# Altium project JLINK-ADPT.PrjPcb
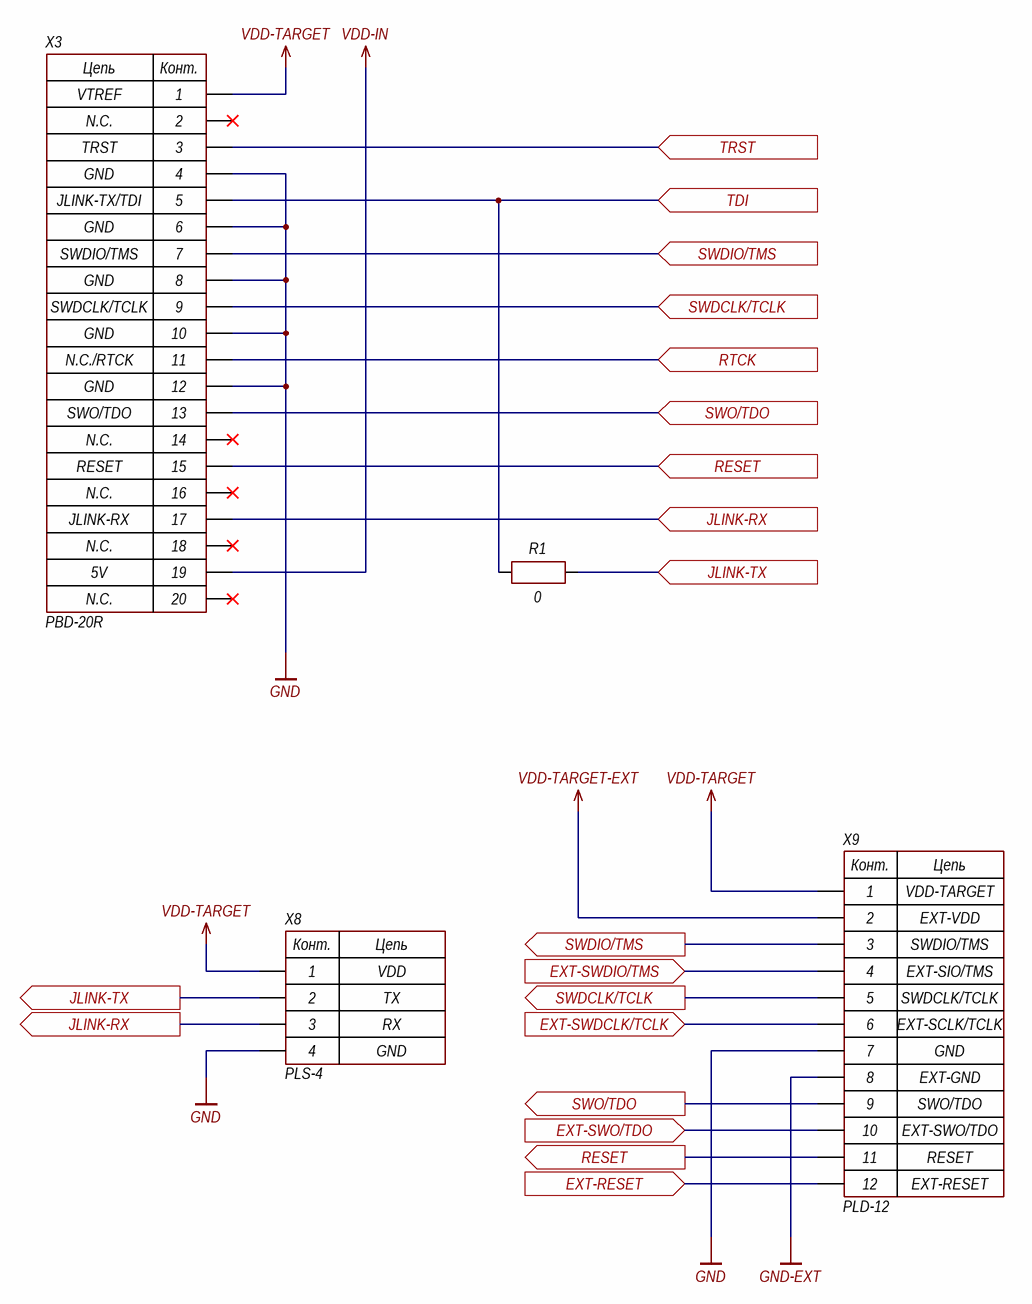
[diagram p0: Connecors-Input.SchDoc]
ProjectVersion: 1.1; ProjectNumberAssembly: JLINK-ADPT-MAINB-1.0 СБ; ProjectNumber: JLINK-ADPT; ProjectDescription: J-link adapter board with different connectors; ProjectDateShort: 2021.10; ProjectDate: 31.10.2021; ProjectCompanyName: Azek Clark © 2021; ProjectBoardType: MAINB; ProjectAuthor: Clark A.
4 sheets, 55 parts. Net scope: flat (ports and power ports of the same name join across sheets).
Board file: PCB.PcbDoc
Sheets:
  Connecors-Input.SchDoc
  Connecors-Output.SchDoc
  PowerSupply.SchDoc
  J-Flash.SchDoc

## Sheet Connecors-Input.SchDoc: =ProjectDescription
size 420 x 297 mm; Author: Clark A.; CompanyName: Azek Clark © 2021; Address1: Address1; Address2: Address2; Address3: Address3; Address4: Address4; DocumentNumber: JLINK-ADPT-1.1-MAINB Э3; SheetNumber: 1; SheetTotal: 3; Scale: 1:1; DocumentType: Схема электрическая принципиальная; FirstReferrence: JLINK-ADPT

### Parts
R1  0  [CH0402R]
X3  PBD-20R  [CON: PBD-20R]
X8  PLS-4  [CON: PLS-4]
X9  PLD-12  [CON: PLD-12]

### Ports
EXT-RESET (in), EXT-SWDCLK/TCLK (in), EXT-SWDIO/TMS (in), EXT-SWO/TDO (in), JLINK-RX (in), JLINK-RX (out), JLINK-TX (in), JLINK-TX (out), RESET (in), RESET (out), RTCK (in), SWDCLK/TCLK (in), SWDCLK/TCLK (out), SWDIO/TMS (in), SWDIO/TMS (out), SWO/TDO (in), SWO/TDO (out), TDI (in), TRST (in)

### Nets
GND: X3.4 X3.6 X3.8 X3.10 X3.12 X8.4 X9.7
GND-EXT: X9.8
VDD-IN: X3.19
VDD-TARGET: X3.1 X8.1 X9.1
VDD-TARGET-EXT: X9.2
EXT-RESET: X9.12 ; port EXT-RESET
EXT-SWDCLK/TCLK: X9.6 ; port EXT-SWDCLK/TCLK
EXT-SWDIO/TMS: X9.4 ; port EXT-SWDIO/TMS
EXT-SWO/TDO: X9.10 ; port EXT-SWO/TDO
JLINK-RX: X3.17 X8.3 ; port JLINK-RX
JLINK-TX: R1.2 X8.2 ; port JLINK-TX
RESET: X3.15 X9.11 ; port RESET
RTCK: X3.11 ; port RTCK
SWDCLK/TCLK: X3.9 X9.5 ; port SWDCLK/TCLK
SWDIO/TMS: X3.7 X9.3 ; port SWDIO/TMS
SWO/TDO: X3.13 X9.9 ; port SWO/TDO
TDI: R1.1 X3.5 ; port TDI
TRST: X3.3 ; port TRST

Not connected (* = marked no-connect by the designer): X3 2* 14* 16* 18* 20*

### Notes on the sheet
- VTREF
- N.C.
- TRST
- GND
- JLINK-TX/TDI
- SWDIO/TMS
- SWDCLK/TCLK
- N.C./RTCK
- SWO/TDO
- JLINK-RX
- RESET
- 5V
- EXT-VDD
- VDD-TARGET
- VDD
- EXT-SIO/TMS
- TX
- RX
- (near X9) EXT-SCLK/TCLK
- EXT-SWO/TDO
- EXT-GND
- EXT-RESET
- Разраб.
- Изм.
- Лист
- № докум.
- Подп.
- Дата
- Лит.
- Масса
- Масштаб
- Пров.
- Т.контр.
- Листов
- Утв.
- Н.контр.
- 2.106-A3
- Копировал
- Формат А3
- (in symbol 4-Connector) Конт.; Цепь
- (in symbol 12-Connector) Конт.; Цепь
- (in symbol 20-Connector) Цепь; Конт.

### Library data of the parts
R1 = Resistor: Manufacturer: *; Model: *; HelpURL: *; ComponentKind: *; Value: 0; ClassName: JLINK-CONNECTOR
X3 = 20-Connector: Model: PBD-20R; Manufacturer: *; HelpURL: *; ComponentKind: *; ClassName: JLINK-CONNECTOR
X8 = 4-Connector: Model: PLS-4; Manufacturer: *; HelpURL: *; ComponentKind: *; ClassName: *
X9 = 12-Connector: Model: PLD-12; Manufacturer: *; HelpURL: *; ComponentKind: *

## Sheet Connecors-Output.SchDoc: =ProjectDescription
size 420 x 297 mm; Author: Clark A.; CompanyName: Azek Clark © 2021; Address1: Address1; Address2: Address2; Address3: Address3; Address4: Address4; DocumentNumber: JLINK-ADPT-1.1-MAINB Э3; SheetNumber: 2; SheetTotal: 4; Scale: 1:1; DocumentType: Схема электрическая принципиальная; FirstReferrence: JLINK-ADPT
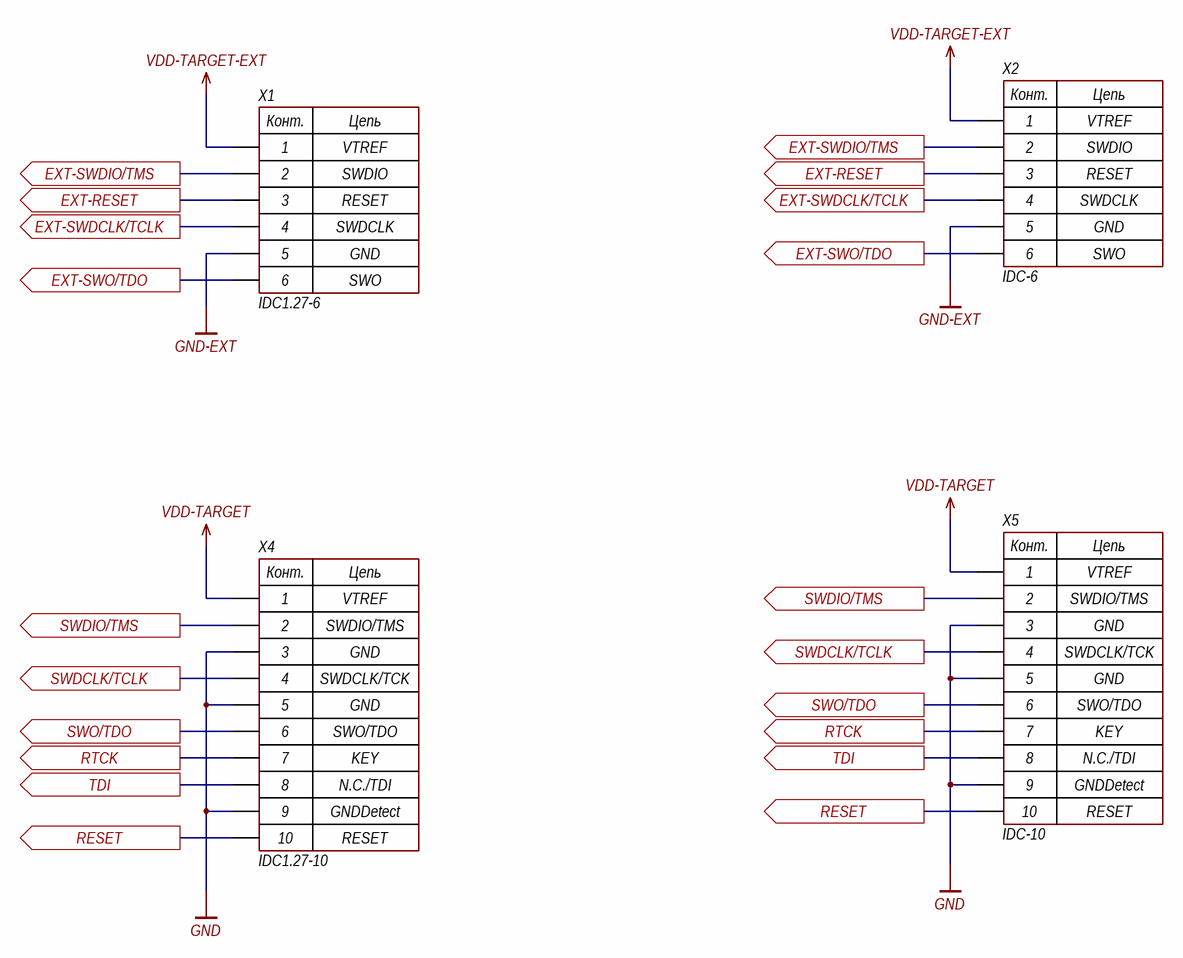
[diagram p1: Connecors-Output.SchDoc]

### Parts
X1  IDC1.27-6  [CON: IDC1.27-6]
X2  IDC-6  [CON: IDC-6MS]
X4  IDC1.27-10  [CON: IDC1.27-10]
X5  IDC-10  [CON: IDC-10MS]

### Ports
EXT-RESET (out), EXT-SWDCLK/TCLK (out), EXT-SWDIO/TMS (out), EXT-SWO/TDO (out), RESET (out), RTCK (out), SWDCLK/TCLK (out), SWDIO/TMS (out), SWO/TDO (out), TDI (out)

### Nets
GND: X4.3 X4.5 X4.9 X5.3 X5.5 X5.9
GND-EXT: X1.5 X2.5
VDD-TARGET: X4.1 X5.1
VDD-TARGET-EXT: X1.1 X2.1
EXT-RESET: X1.3 X2.3 ; port EXT-RESET
EXT-SWDCLK/TCLK: X1.4 X2.4 ; port EXT-SWDCLK/TCLK
EXT-SWDIO/TMS: X1.2 X2.2 ; port EXT-SWDIO/TMS
EXT-SWO/TDO: X1.6 X2.6 ; port EXT-SWO/TDO
RESET: X4.10 X5.10 ; port RESET
RTCK: X4.7 X5.7 ; port RTCK
SWDCLK/TCLK: X4.4 X5.4 ; port SWDCLK/TCLK
SWDIO/TMS: X4.2 X5.2 ; port SWDIO/TMS
SWO/TDO: X4.6 X5.6 ; port SWO/TDO
TDI: X4.8 X5.8 ; port TDI

### Notes on the sheet
- VTREF
- SWDIO
- SWDCLK
- RESET
- GND
- SWO
- SWDIO/TMS
- SWDCLK/TCK
- KEY
- SWO/TDO
- N.C./TDI
- GNDDetect
- Изм.
- Лист
- № докум.
- Подп.
- Дата
- 2.106-A3
- Копировал
- Формат А3
- (in symbol 6-Connector) Конт.; Цепь
- (in symbol 10-Connector) Конт.; Цепь

### Library data of the parts
X1 X2 = 6-Connector: Manufacturer: *; HelpURL: *; ComponentKind: *; ClassName: *
  X1: Model: IDC1.27-6
  X2: Model: IDC-6
X4 X5 = 10-Connector: Manufacturer: *; HelpURL: *; ComponentKind: *; ClassName: *
  X4: Model: IDC1.27-10
  X5: Model: IDC-10

## Sheet PowerSupply.SchDoc: =ProjectDescription
size 420 x 297 mm; Author: Clark A.; CompanyName: Azek Clark © 2021; Address1: Address1; Address2: Address2; Address3: Address3; Address4: Address4; DocumentNumber: JLINK-ADPT-1.1-MAINB Э3; SheetNumber: 2; SheetTotal: 2; Scale: 1:1; DocumentType: Схема электрическая принципиальная; FirstReferrence: JLINK-ADPT
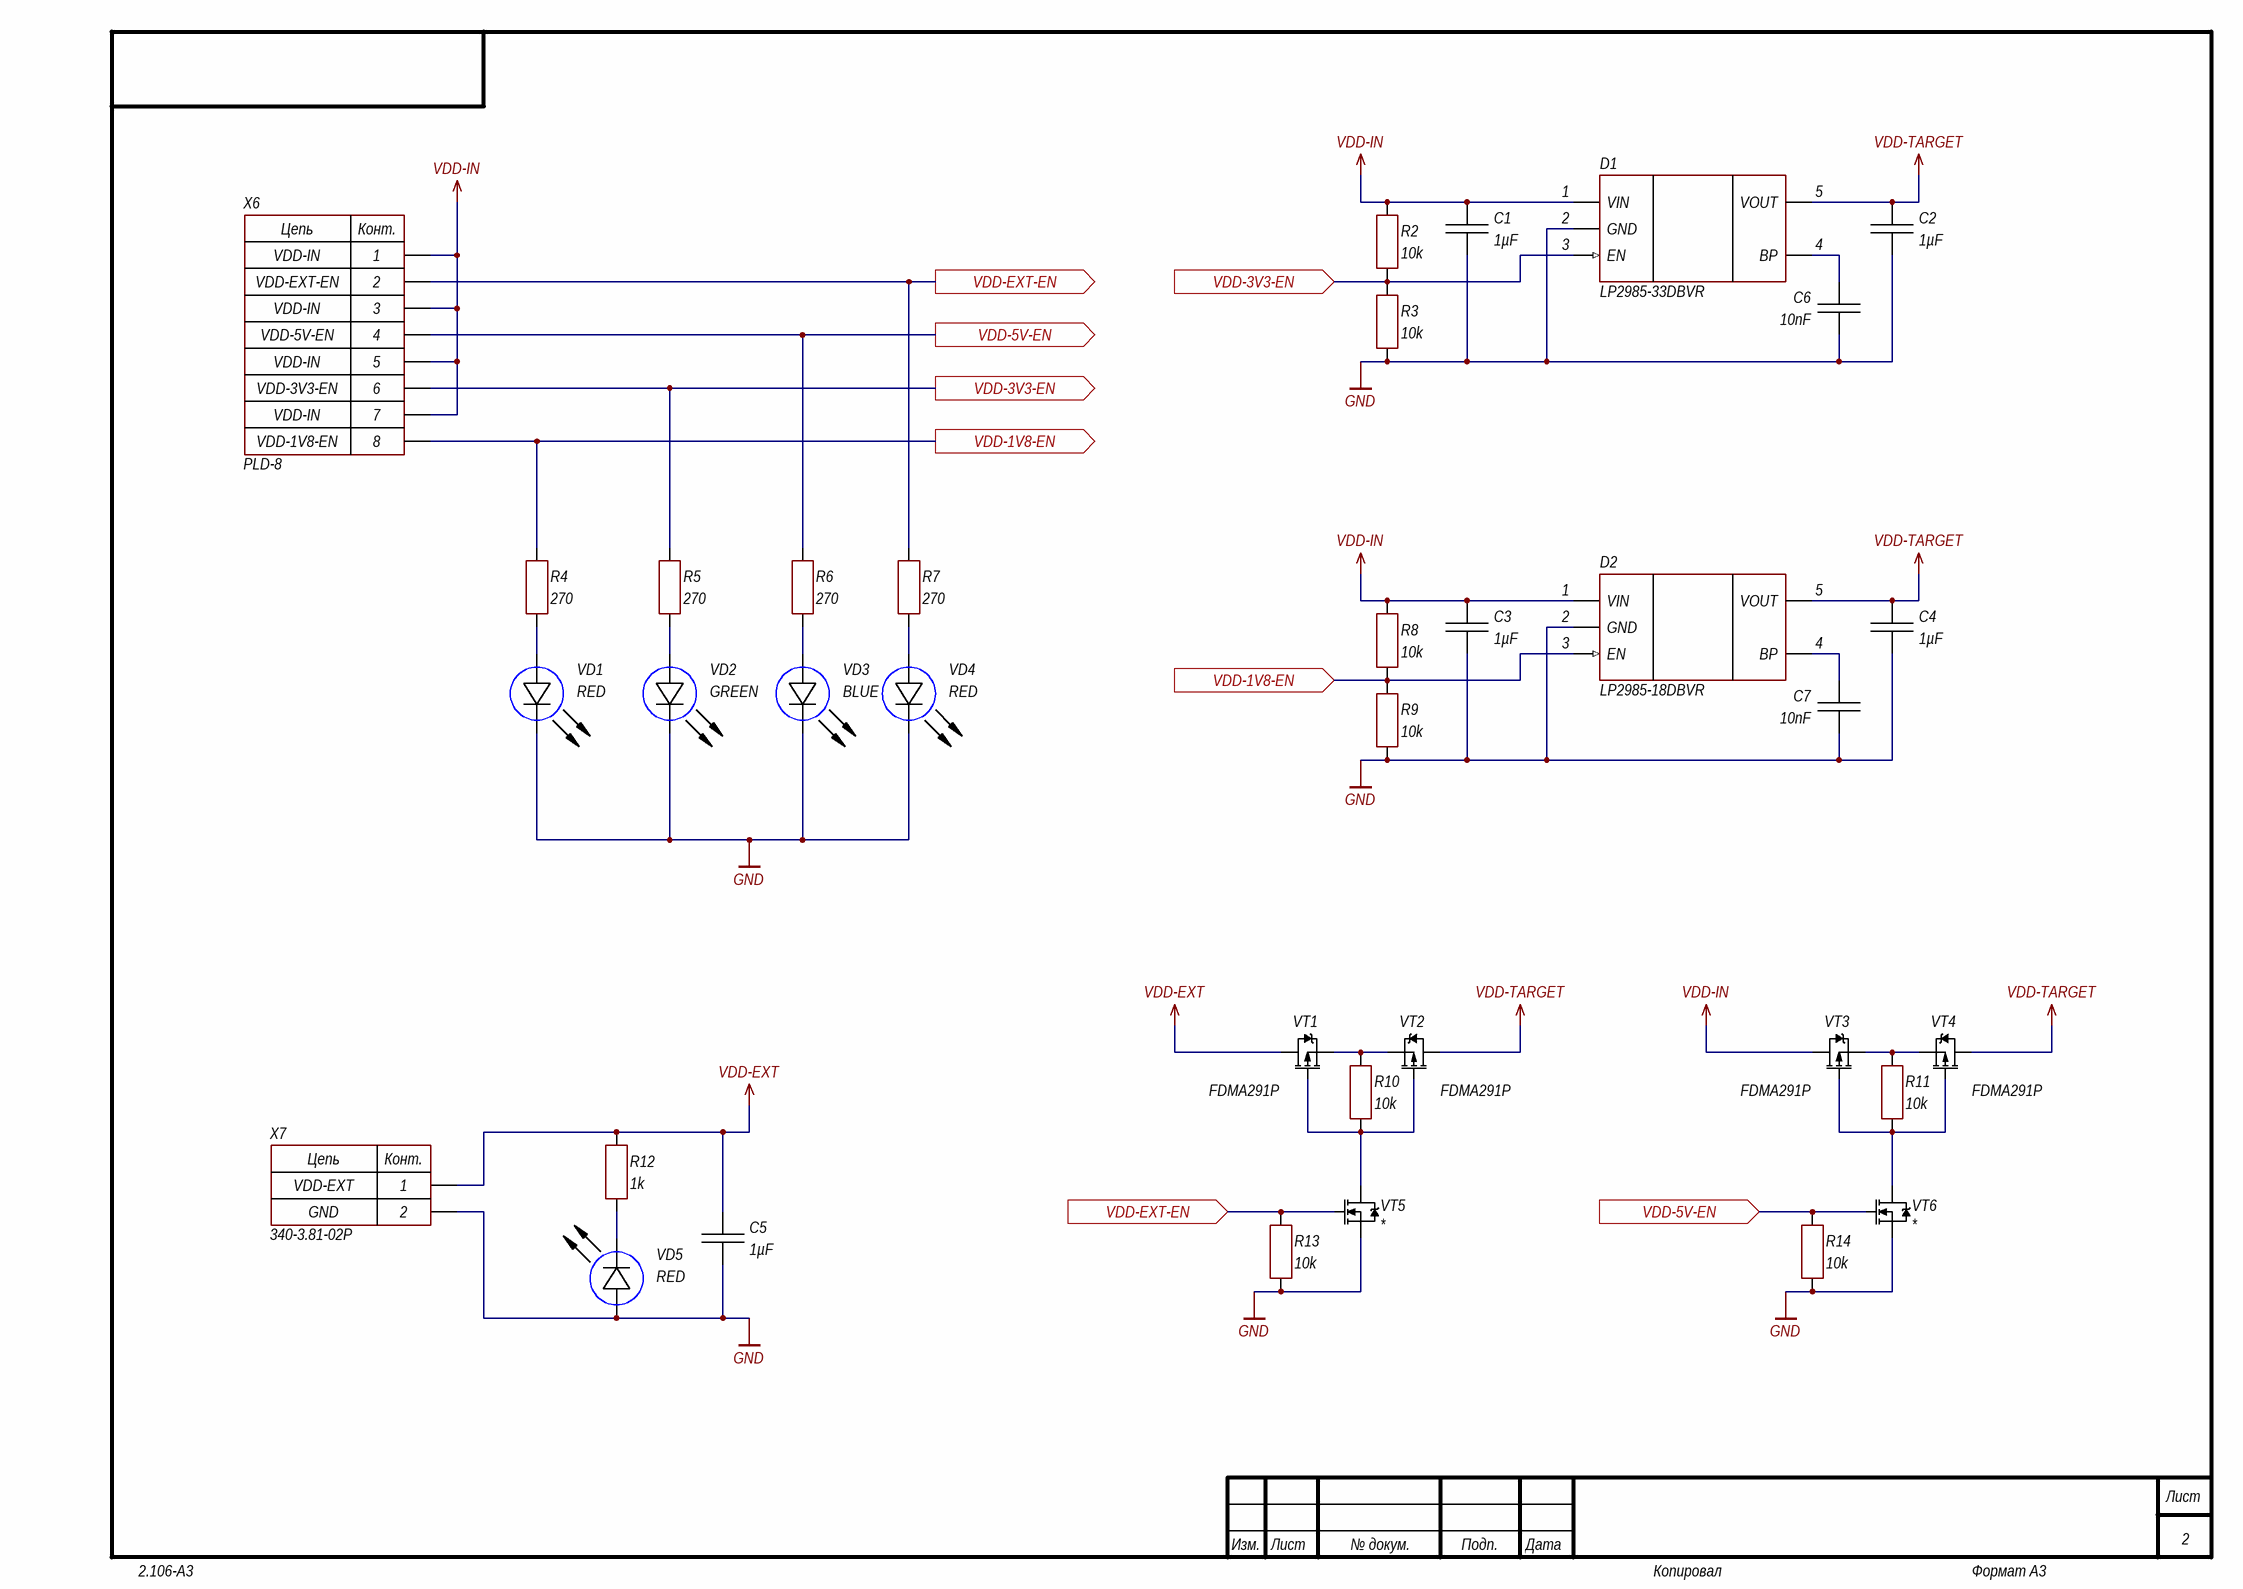
[diagram p2: PowerSupply.SchDoc]

### Parts
C1  1µF  [CH0603CM]
C2  1µF  [CH0603CM]
C3  1µF  [CH0603CM]
C4  1µF  [CH0603CM]
C5  1µF  [CH0603CM]
C6  10nF  [CH0603CM]
C7  10nF  [CH0603CM]
D1  LP2985-33DBVR  [SOT23-5]
D2  LP2985-18DBVR  [SOT23-5]
R2  10k  [CH0402R]
R3  10k  [CH0402R]
R4  270  [CH0402R]
R5  270  [CH0402R]
R6  270  [CH0402R]
R7  270  [CH0402R]
R8  10k  [CH0402R]
R9  10k  [CH0402R]
R10  10k  [CH0402R]
R11  10k  [CH0402R]
R12  1k  [CH0402R]
R13  10k  [CH0402R]
R14  10k  [CH0402R]
VD1  RED  [CH0402LR]
VD2  GREEN  [CH0402LG]
VD3  BLUE  [CH0402LB]
VD4  RED  [CH0402LR]
VD5  RED  [CH0402LR]
VT1  FDMA291P  [MicroFET 2x2]
VT2  FDMA291P  [MicroFET 2x2]
VT3  FDMA291P  [MicroFET 2x2]
VT4  FDMA291P  [MicroFET 2x2]
VT5  *  [DFN1006-3L]
VT6  *  [DFN1006-3L]
X6  PLD-8  [CON: PLD-8]
X7  340-3.81-02P  [CON: 340-3.81-02P]

### Ports
VDD-1V8-EN (in), VDD-1V8-EN (out), VDD-3V3-EN (in), VDD-3V3-EN (out), VDD-5V-EN (in), VDD-5V-EN (out), VDD-EXT-EN (in), VDD-EXT-EN (out)

### Nets
GND: C1.1 C2.1 C3.1 C4.1 C5.1 C6.1 C7.1 D1.2(GND) D2.2(GND) R3.1 R9.1 R13.1 R14.1 VD1.2(C) VD2.2(C) VD3.2(C) VD4.2(C) VD5.1(A) VT5.3(S) VT6.3(S) X7.2
VDD-EXT: C5.2 R12.2 VT1.2(D) X7.1
VDD-IN: C1.2 C3.2 D1.1(VIN) D2.1(VIN) R2.2 R8.2 VT3.2(D) X6.1 X6.3 X6.5 X6.7
VDD-TARGET: C2.2 C4.2 D1.5(VOUT) D2.5(VOUT) VT2.2(D) VT4.2(D)
VDD-1V8-EN: D2.3(EN) R4.2 R8.1 R9.2 X6.8 ; port VDD-1V8-EN
VDD-3V3-EN: D1.3(EN) R2.1 R3.2 R5.2 X6.6 ; port VDD-3V3-EN
VDD-5V-EN: R6.2 R14.2 VT6.1(G) X6.4 ; port VDD-5V-EN
VDD-EXT-EN: R7.2 R13.2 VT5.1(G) X6.2 ; port VDD-EXT-EN
NetC6_2: C6.2 D1.4(BP)
NetC7_2: C7.2 D2.4(BP)
NetR4_1: R4.1 VD1.1(A)
NetR5_1: R5.1 VD2.1(A)
NetR6_1: R6.1 VD3.1(A)
NetR7_1: R7.1 VD4.1(A)
NetR10_1: R10.1 VT1.1(G) VT2.1(G) VT5.2(D)
NetR10_2: R10.2 VT1.3(S) VT2.3(S)
NetR11_1: R11.1 VT3.1(G) VT4.1(G) VT6.2(D)
NetR11_2: R11.2 VT3.3(S) VT4.3(S)
NetR12_1: R12.1 VD5.2(C)

### Notes on the sheet
- VDD-IN
- VDD-EXT-EN
- VDD-5V-EN
- VDD-3V3-EN
- VDD-1V8-EN
- VDD-EXT
- GND
- Изм.
- Лист
- № докум.
- Подп.
- Дата
- 2.106-A3
- Копировал
- Формат А3
- (in symbol 2-Connector) Цепь; Конт.
- (in symbol 8-Connector) Цепь; Конт.

### Library data of the parts
C1-C7 = Capacitor: Manufacturer: *; Model: *; HelpURL: *; ComponentKind: *
  C1 C2: Value: 1µF; ClassName: LDO-3V3
  C3 C4: Value: 1µF; ClassName: LDO-1V8
  C5: Value: 1µF; ClassName: VDD-EXT-CONNECTOR
  C6: Value: 10nF; ClassName: LDO-3V3
  C7: Value: 10nF; ClassName: LDO-1V8
D1 D2 = LP2985-33DBVR: LDO; Manufacturer: Texas Instruments; HelpURL: https://www.digikey.com/product-detail/en/texas-instruments/LP2985-33DBVR/296-18476-1-ND/809911; ComponentKind: SOT-23-5
  D1: Model: LP2985-33DBVR; ClassName: LDO-3V3
  D2: Model: LP2985-18DBVR; ClassName: LDO-1V8
R2-R14 = Resistor: Manufacturer: *; Model: *; HelpURL: *; ComponentKind: *
  R2 R3: Value: 10k; ClassName: LDO-3V3
  R4-R7: Value: 270; ClassName: VDD-SWITCH
  R8 R9: Value: 10k; ClassName: LDO-1V8
  R10 R13: Value: 10k; ClassName: VDD-EXT-SWITCH
  R11 R14: Value: 10k; ClassName: VDD-5V-SWITCH
  R12: Value: 1k; ClassName: VDD-EXT-CONNECTOR
VD1-VD5 = LED: Manufacturer: *; Model: *; HelpURL: *; ComponentKind: *
  VD1 VD4: Value: RED; ClassName: VDD-SWITCH
  VD2: Value: GREEN; ClassName: VDD-SWITCH
  VD3: Value: BLUE; ClassName: VDD-SWITCH
  VD5: Value: RED; ClassName: VDD-EXT-CONNECTOR
VT1-VT4 = P-chanel: Mosfet; pin to pad: 1>3 2>1 3>2; Model: FDMA291P; Manufacturer: *; ComponentKind: *; HelpURL: *
  VT1 VT2: ClassName: VDD-EXT-SWITCH
  VT3 VT4: ClassName: VDD-5V-SWITCH
VT5 VT6 = N-chanel: Mosfet; Model: *; Manufacturer: *; ComponentKind: *; HelpURL: *
  VT5: ClassName: VDD-EXT-SWITCH
  VT6: ClassName: VDD-5V-SWITCH
X6 = 8-Connector: Model: PLD-8; Manufacturer: *; HelpURL: *; ComponentKind: *; ClassName: VDD-SWITCH
X7 = 2-Connector: Model: 340-3.81-02P; Manufacturer: *; HelpURL: *; ComponentKind: *; ClassName: VDD-EXT-CONNECTOR

## Sheet J-Flash.SchDoc: =ProjectDescription
size 420 x 297 mm; Author: Clark A.; CompanyName: Azek Clark © 2021; Address1: Address1; Address2: Address2; Address3: Address3; Address4: Address4; DocumentNumber: JLINK-ADPT-1.1-MAINB Э3; SheetNumber: 4; SheetTotal: 3; Scale: 1:1; DocumentType: Схема электрическая принципиальная; FirstReferrence: JLINK-ADPT
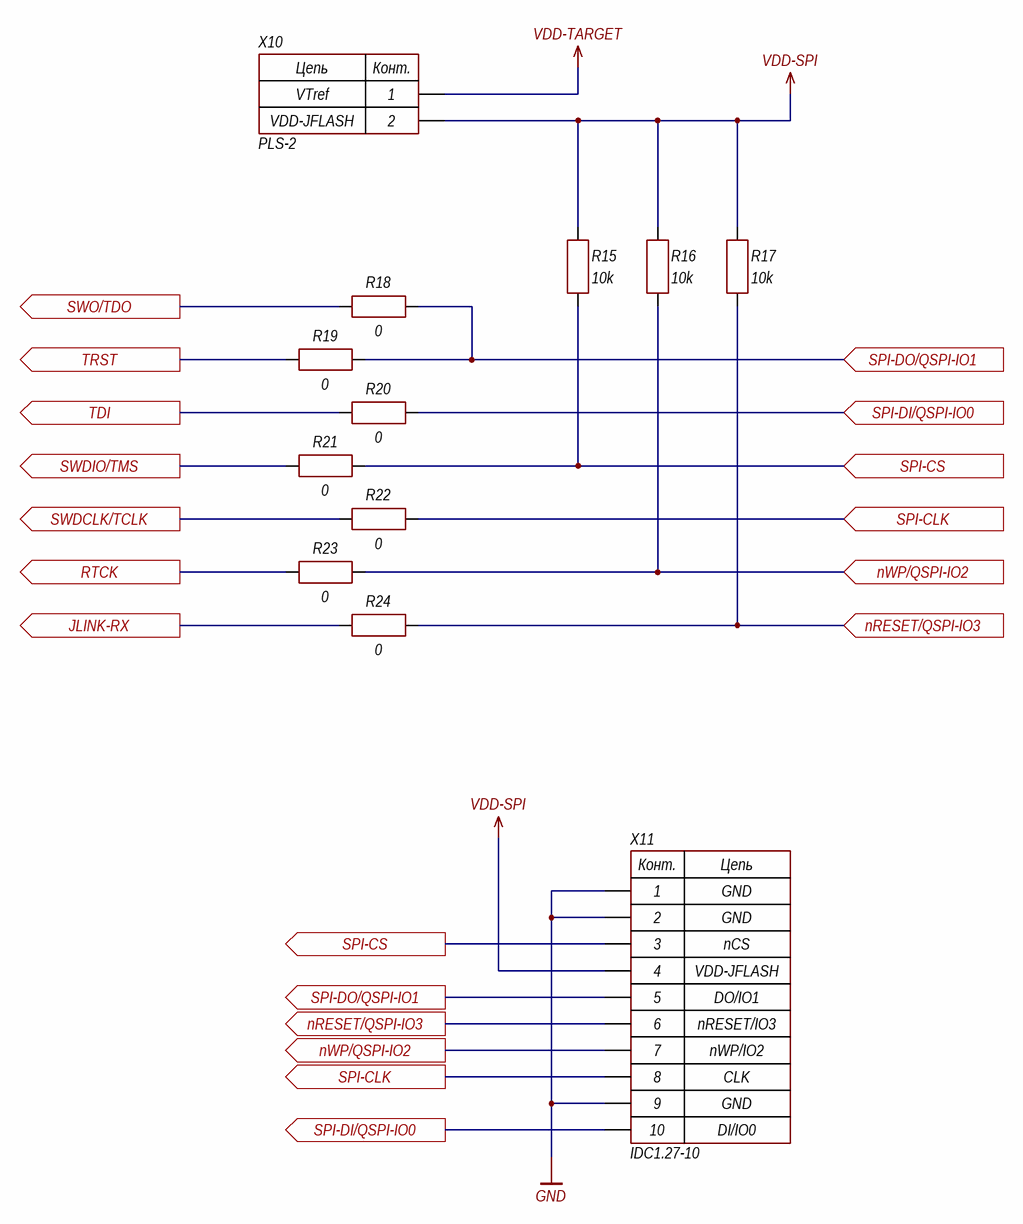
[diagram p3: J-Flash.SchDoc]

### Parts
R15  10k  [CH0402R]
R16  10k  [CH0402R]
R17  10k  [CH0402R]
R18  0  [CH0402R]
R19  0  [CH0402R]
R20  0  [CH0402R]
R21  0  [CH0402R]
R22  0  [CH0402R]
R23  0  [CH0402R]
R24  0  [CH0402R]
X10  PLS-2  [CON: PLS-2]
X11  IDC1.27-10  [CON: IDC1.27-10]

### Ports
JLINK-RX (out), nRESET/QSPI-IO3 (in), nRESET/QSPI-IO3 (out), nWP/QSPI-IO2 (in), nWP/QSPI-IO2 (out), RTCK (out), SPI-CLK (in), SPI-CLK (out), SPI-CS (in), SPI-CS (out), SPI-DI/QSPI-IO0 (in), SPI-DI/QSPI-IO0 (out), SPI-DO/QSPI-IO1 (in), SPI-DO/QSPI-IO1 (out), SWDCLK/TCLK (out), SWDIO/TMS (out), SWO/TDO (out), TDI (out), TRST (out)

### Nets
GND: X11.1 X11.2 X11.9
VDD-SPI: R15.2 R16.2 R17.2 X10.2 X11.4
VDD-TARGET: X10.1
JLINK-RX: R24.1 ; port JLINK-RX
nRESET/QSPI-IO3: R17.1 R24.2 X11.6 ; port nRESET/QSPI-IO3
nWP/QSPI-IO2: R16.1 R23.2 X11.7 ; port nWP/QSPI-IO2
RTCK: R23.1 ; port RTCK
SPI-CLK: R22.2 X11.8 ; port SPI-CLK
SPI-CS: R15.1 R21.2 X11.3 ; port SPI-CS
SPI-DI/QSPI-IO0: R20.2 X11.10 ; port SPI-DI/QSPI-IO0
SPI-DO/QSPI-IO1: R18.2 R19.2 X11.5 ; port SPI-DO/QSPI-IO1
SWDCLK/TCLK: R22.1 ; port SWDCLK/TCLK
SWDIO/TMS: R21.1 ; port SWDIO/TMS
SWO/TDO: R18.1 ; port SWO/TDO
TDI: R20.1 ; port TDI
TRST: R19.1 ; port TRST

### Notes on the sheet
- VTref
- VDD-JFLASH
- GND
- nCS
- nWP/IO2
- nRESET/IO3
- DO/IO1
- DI/IO0
- CLK
- Изм.
- Лист
- № докум.
- Подп.
- Дата
- 2.106-A3
- Копировал
- Формат А3
- (in symbol 2-Connector) Цепь; Конт.
- (in symbol 10-Connector) Конт.; Цепь

### Library data of the parts
R15-R24 = Resistor: Manufacturer: *; Model: *; HelpURL: *; ComponentKind: *; ClassName: J-FLASH
  R15-R17: Value: 10k
  R18-R24: Value: 0
X10 = 2-Connector: Model: PLS-2; Manufacturer: *; HelpURL: *; ComponentKind: *; ClassName: J-FLASH
X11 = 10-Connector: Model: IDC1.27-10; Manufacturer: *; HelpURL: *; ComponentKind: *; ClassName: J-FLASH

## Nets that join several sheets
GND: Connecors-Input (7 pins), Connecors-Output (6 pins), PowerSupply (21 pins), J-Flash (X11.1 X11.2 X11.9)
GND-EXT: Connecors-Input (X9.8), Connecors-Output (X1.5 X2.5)
VDD-IN: Connecors-Input (X3.19), PowerSupply (11 pins)
VDD-TARGET: Connecors-Input (X3.1 X8.1 X9.1), Connecors-Output (X4.1 X5.1), PowerSupply (6 pins), J-Flash (X10.1)
VDD-TARGET-EXT: Connecors-Input (X9.2), Connecors-Output (X1.1 X2.1)
EXT-RESET: Connecors-Input (X9.12), Connecors-Output (X1.3 X2.3)
EXT-SWDCLK/TCLK: Connecors-Input (X9.6), Connecors-Output (X1.4 X2.4)
EXT-SWDIO/TMS: Connecors-Input (X9.4), Connecors-Output (X1.2 X2.2)
EXT-SWO/TDO: Connecors-Input (X9.10), Connecors-Output (X1.6 X2.6)
JLINK-RX: Connecors-Input (X3.17 X8.3), J-Flash (R24.1)
RESET: Connecors-Input (X3.15 X9.11), Connecors-Output (X4.10 X5.10)
RTCK: Connecors-Input (X3.11), Connecors-Output (X4.7 X5.7), J-Flash (R23.1)
SWDCLK/TCLK: Connecors-Input (X3.9 X9.5), Connecors-Output (X4.4 X5.4), J-Flash (R22.1)
SWDIO/TMS: Connecors-Input (X3.7 X9.3), Connecors-Output (X4.2 X5.2), J-Flash (R21.1)
SWO/TDO: Connecors-Input (X3.13 X9.9), Connecors-Output (X4.6 X5.6), J-Flash (R18.1)
TDI: Connecors-Input (R1.1 X3.5), Connecors-Output (X4.8 X5.8), J-Flash (R20.1)
TRST: Connecors-Input (X3.3), J-Flash (R19.1)